# Altium schematic sheet Inputs.SchDoc
size A4; SheetNumber: 8; SheetTotal: 9
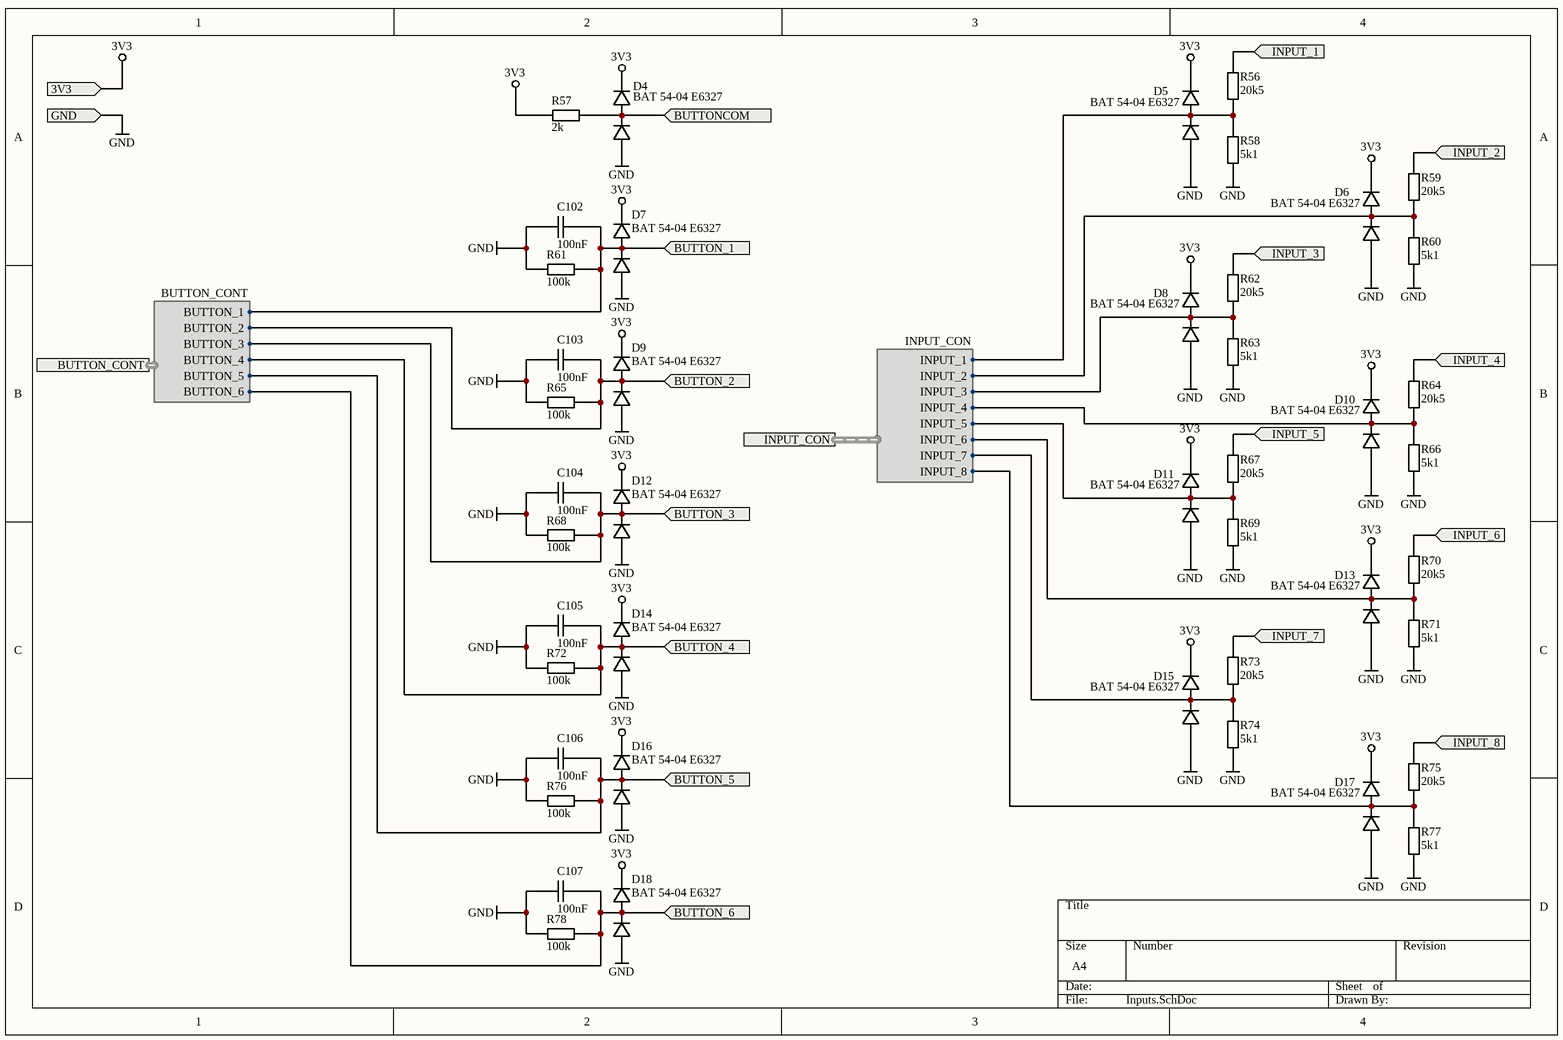
[diagram p0: Inputs.SchDoc]

## Parts
C102  100nF  [C_0402]
C103  100nF  [C_0402]
C104  100nF  [C_0402]
C105  100nF  [C_0402]
C106  100nF  [C_0402]
C107  100nF  [C_0402]
D4  BAT 54-04 E6327  [SOT95P240X110-3N]
D5  BAT 54-04 E6327  [SOT95P240X110-3N]
D6  BAT 54-04 E6327  [SOT95P240X110-3N]
D7  BAT 54-04 E6327  [SOT95P240X110-3N]
D8  BAT 54-04 E6327  [SOT95P240X110-3N]
D9  BAT 54-04 E6327  [SOT95P240X110-3N]
D10  BAT 54-04 E6327  [SOT95P240X110-3N]
D11  BAT 54-04 E6327  [SOT95P240X110-3N]
D12  BAT 54-04 E6327  [SOT95P240X110-3N]
D13  BAT 54-04 E6327  [SOT95P240X110-3N]
D14  BAT 54-04 E6327  [SOT95P240X110-3N]
D15  BAT 54-04 E6327  [SOT95P240X110-3N]
D16  BAT 54-04 E6327  [SOT95P240X110-3N]
D17  BAT 54-04 E6327  [SOT95P240X110-3N]
D18  BAT 54-04 E6327  [SOT95P240X110-3N]
R56  20k5  [R_0402]
R57  2k  [R_0402]
R58  5k1  [R_0402]
R59  20k5  [R_0402]
R60  5k1  [R_0402]
R61  100k  [R_0402]
R62  20k5  [R_0402]
R63  5k1  [R_0402]
R64  20k5  [R_0402]
R65  100k  [R_0402]
R66  5k1  [R_0402]
R67  20k5  [R_0402]
R68  100k  [R_0402]
R69  5k1  [R_0402]
R70  20k5  [R_0402]
R71  5k1  [R_0402]
R72  100k  [R_0402]
R73  20k5  [R_0402]
R74  5k1  [R_0402]
R75  20k5  [R_0402]
R76  100k  [R_0402]
R77  5k1  [R_0402]
R78  100k  [R_0402]

## Ports
3V3 (in), BUTTON_1 (in), BUTTON_2 (in), BUTTON_3 (in), BUTTON_4 (in), BUTTON_5 (in), BUTTON_6 (in), BUTTON_CONT (harness BUTTON_CONT), BUTTONCOM (in), GND (in), INPUT_1 (in), INPUT_2 (in), INPUT_3 (in), INPUT_4 (in), INPUT_5 (in), INPUT_6 (in), INPUT_7 (in), INPUT_8 (in), INPUT_CON (harness INPUT_CON)

## Harnesses
BUTTON_CONT: BUTTON_1, BUTTON_2, BUTTON_3, BUTTON_4, BUTTON_5, BUTTON_6
INPUT_CON: INPUT_1, INPUT_2, INPUT_3, INPUT_4, INPUT_5, INPUT_6, INPUT_7, INPUT_8

## Nets
3V3: D4.2 D5.2 D6.2 D7.2 D8.2 D9.2 D10.2 D11.2 D12.2 D13.2 D14.2 D15.2 D16.2 D17.2 D18.2 R57.1 ; port 3V3
GND: C102.1 C103.1 C104.1 C105.1 C106.1 C107.1 D4.1 D5.1 D6.1 D7.1 D8.1 D9.1 D10.1 D11.1 D12.1 D13.1 D14.1 D15.1 D16.1 D17.1 D18.1 R58.1 R60.1 R61.1 R63.1 R65.1 R66.1 R68.1 R69.1 R71.1 R72.1 R74.1 R76.1 R77.1 R78.1 ; port GND
BUTTON_1: C102.2 D7.3 R61.2 ; port BUTTON_1, port BUTTON_CONT.BUTTON_1
BUTTON_2: C103.2 D9.3 R65.2 ; port BUTTON_2, port BUTTON_CONT.BUTTON_2
BUTTON_3: C104.2 D12.3 R68.2 ; port BUTTON_3, port BUTTON_CONT.BUTTON_3
BUTTON_4: C105.2 D14.3 R72.2 ; port BUTTON_4, port BUTTON_CONT.BUTTON_4
BUTTON_5: C106.2 D16.3 R76.2 ; port BUTTON_5, port BUTTON_CONT.BUTTON_5
BUTTON_6: C107.2 D18.3 R78.2 ; port BUTTON_6, port BUTTON_CONT.BUTTON_6
BUTTONCOM: D4.3 R57.2 ; port BUTTONCOM
INPUT_1: R56.2 ; port INPUT_1
INPUT_2: R59.2 ; port INPUT_2
INPUT_3: R62.2 ; port INPUT_3
INPUT_4: R64.2 ; port INPUT_4
INPUT_5: R67.2 ; port INPUT_5
INPUT_6: R70.2 ; port INPUT_6
INPUT_7: R73.2 ; port INPUT_7
INPUT_8: R75.2 ; port INPUT_8
NetD5_3: D5.3 R56.1 R58.2 ; port INPUT_CON.INPUT_1
NetD6_3: D6.3 R59.1 R60.2 ; port INPUT_CON.INPUT_2
NetD8_3: D8.3 R62.1 R63.2 ; port INPUT_CON.INPUT_3
NetD10_3: D10.3 R64.1 R66.2 ; port INPUT_CON.INPUT_4
NetD11_3: D11.3 R67.1 R69.2 ; port INPUT_CON.INPUT_5
NetD13_3: D13.3 R70.1 R71.2 ; port INPUT_CON.INPUT_6
NetD15_3: D15.3 R73.1 R74.2 ; port INPUT_CON.INPUT_7
NetD17_3: D17.3 R75.1 R77.2 ; port INPUT_CON.INPUT_8

## Library data of the parts
C102-C107 = C0402C104J8RACAUTO: 100nF 10V 0402 X7R
D4-D18 = BAT 54-04 E6327: Clamping Diode
R56 R59 R62 R64 R67 R70 R73 R75 = ERJ2RKF2052X: 20k5 1% 100mW
R57 = AC0402FR-072KL: 2k 1% 62.5mW
R58 R60 R63 R66 R69 R71 R74 R77 = MP000528: 5k1 1% 100mW
R61 R65 R68 R72 R76 R78 = CRCW0402100KJNED: 100k 5% 62.5mW